# EAGLE design BaseMachine_Exio_Board (EAGLE 7.2.0)
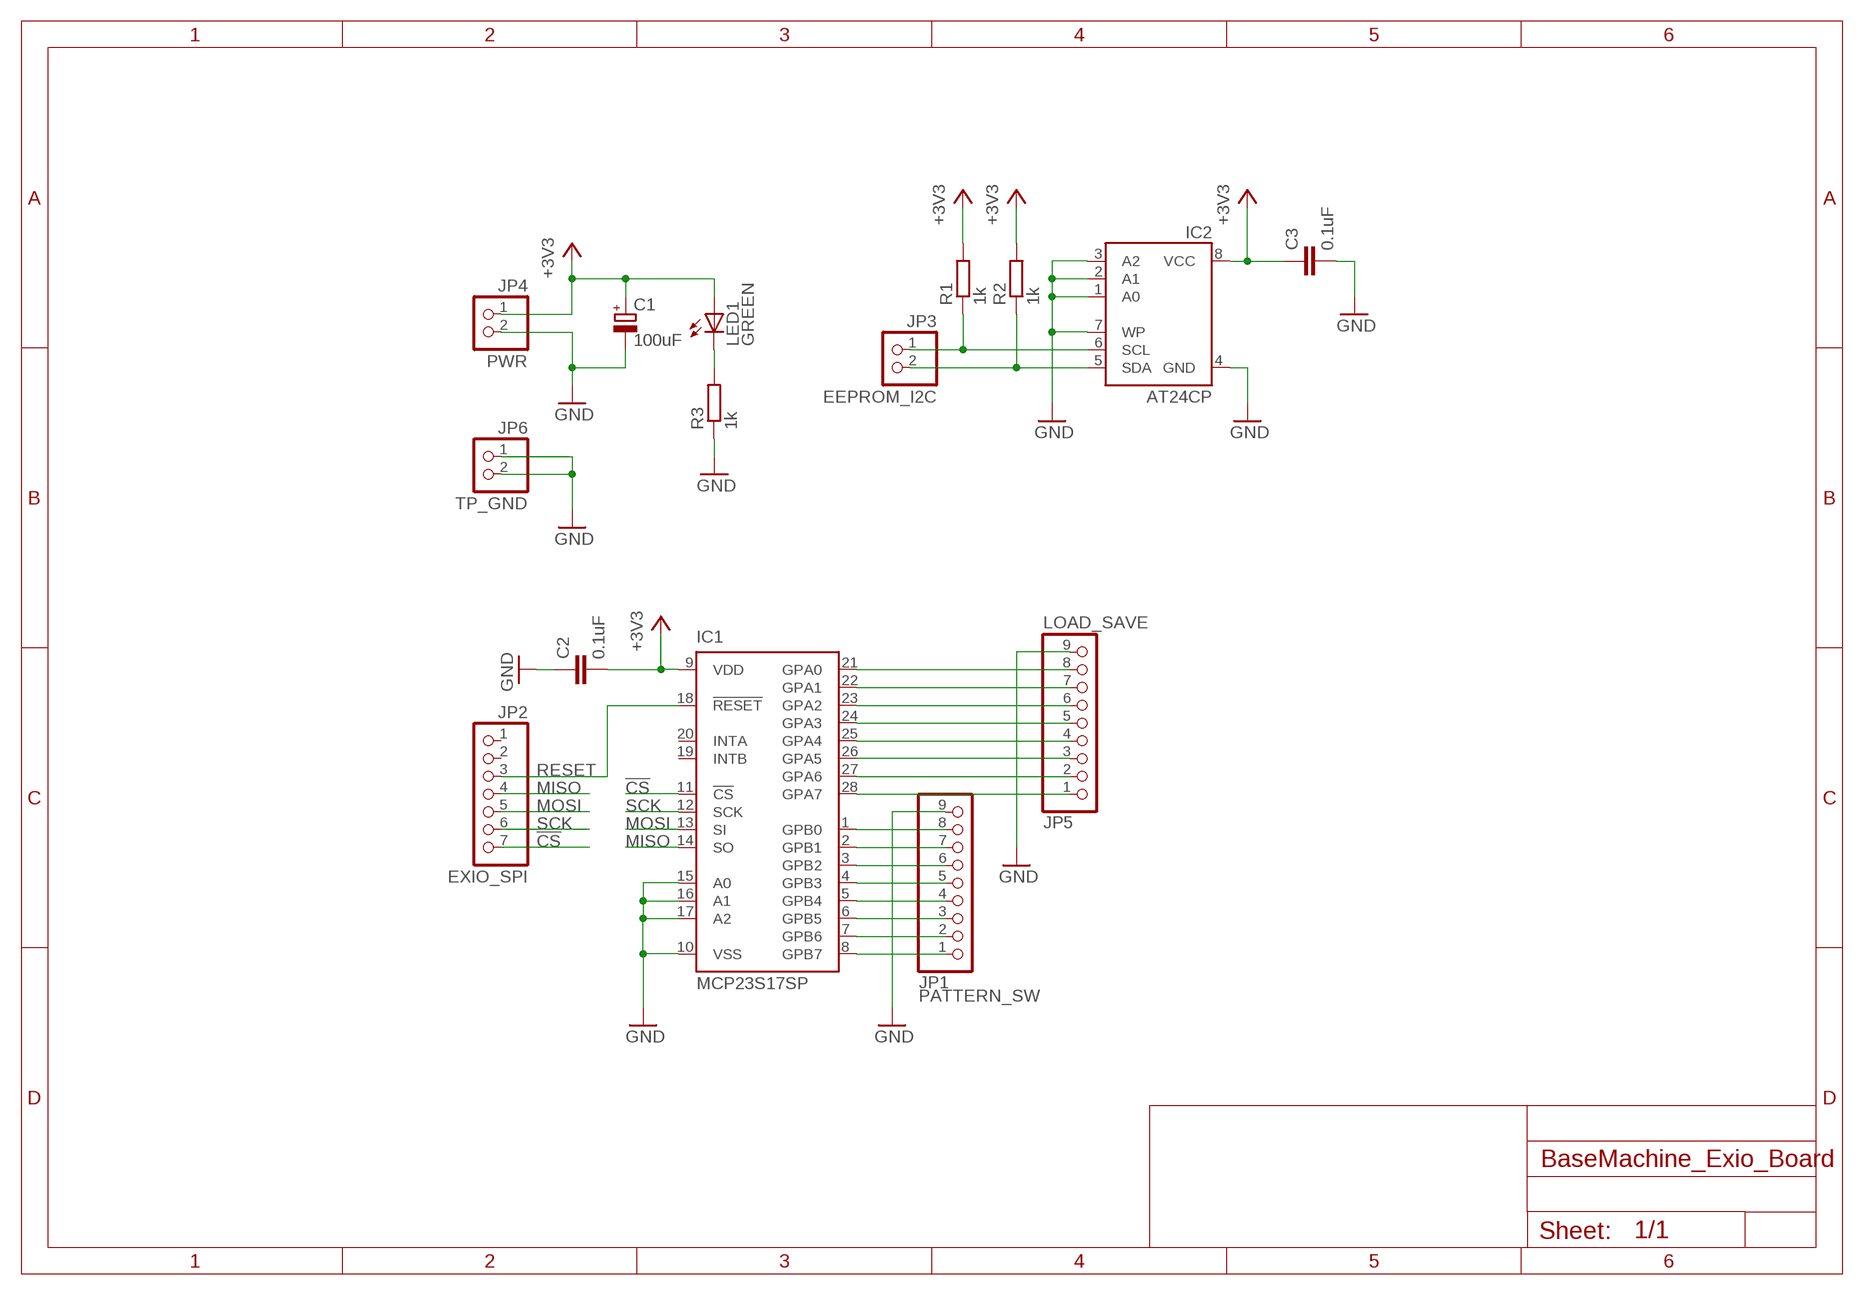
[diagram p0: schematic, sheet 1]

## Parts
C1  100uF  CPOL-EUSANYO_C6  [SANYO-OSCON_C6]
C2  0.1uF  C-EU025-024X044  [C025-024X044]
C3  0.1uF  C-EU025-024X044  [C025-024X044]
IC1  MCP23S17SP  [DIL28-3]
IC2  AT24CP  [DIL08]
JP1  PATTERN_SW  PINHD-1X9/90  [1X09/90]
JP2  EXIO_SPI  PINHD-1X7/90  [1X07/90]
JP3  EEPROM_I2C  PINHD-1X2/90  [1X02/90]
JP4  PWR  PINHD-1X2/90  [1X02/90]
JP5  LOAD_SAVE  PINHD-1X9/90  [1X09/90]
JP6  TP_GND  PINHD-1X2  [1X02]
LED1  GREEN  LED3MM  [LED3MM]
R1  1k  R-EU_0207/7  [0207/7]
R2  1k  R-EU_0207/7  [0207/7]
R3  1k  R-EU_0207/7  [0207/7]

## Nets
!CS: IC1.11(!CS) JP2.7
+3V3: C1.+ C2.2 C3.1 IC1.9(VDD) IC2.8(VCC) JP4.1 LED1.A R1.2 R2.2
GND: C1.- C2.1 C3.2 IC1.10(VSS) IC1.15(A0) IC1.16(A1) IC1.17(A2) IC2.1(A0) IC2.2(A1) IC2.3(A2) IC2.4(GND) IC2.7(WP) JP1.9 JP4.2 JP5.9 JP6.1 JP6.2 R3.1
MISO: IC1.14(SO) JP2.4
MOSI: IC1.13(SI) JP2.5
N$1: IC1.1(GPB0) JP1.8
N$2: IC1.2(GPB1) JP1.7
N$3: IC1.3(GPB2) JP1.6
N$4: IC1.4(GPB3) JP1.5
N$5: IC1.5(GPB4) JP1.4
N$6: IC1.6(GPB5) JP1.3
N$8: IC2.6(SCL) JP3.1 R1.1
N$9: IC2.5(SDA) JP3.2 R2.1
N$10: IC1.7(GPB6) JP1.2
N$11: IC1.21(GPA0) JP5.8
N$12: IC1.22(GPA1) JP5.7
N$13: IC1.23(GPA2) JP5.6
N$14: IC1.8(GPB7) JP1.1
N$21: IC1.24(GPA3) JP5.5
N$22: IC1.25(GPA4) JP5.4
N$23: IC1.26(GPA5) JP5.3
N$24: LED1.K(C) R3.2
N$25: IC1.27(GPA6) JP5.2
N$26: IC1.28(GPA7) JP5.1
RESET: IC1.18(!RESET) JP2.3
SCK: IC1.12(SCK) JP2.6
Unconnected: IC1.19(INTB) IC1.20(INTA) JP2.1 JP2.2

## Library data of the parts
C1 = rcl:CPOL-EU: POLARIZED CAPACITOR, European symbol
C2 C3 = rcl:C-EU: CAPACITOR, European symbol
IC1 = microchip:MCP23S17: http://ww1.microchip.com/downloads/en/DeviceDoc/21952a.pdf Source: http://ww1.microchip.com/downloads/en/DeviceDoc/21952a.pdf; MF: MICROCHIP; MPN: MCP23S17-E/SP; OC_FARNELL: 1292238; OC_NEWARK: 31K2951
IC2 = atmel:AT24C*: 2-wire serial EEPROM; MPN: AT24C1024BW-SH-B; OC_FARNELL: 1362646; OC_NEWARK: 03P2044
JP1 JP5 = pinhead:PINHD-1X9: PIN HEADER
JP2 = pinhead:PINHD-1X7: PIN HEADER
JP3 JP4 JP6 = pinhead:PINHD-1X2: PIN HEADER
LED1 = led:LED: LED OSRAM: - CHIPLED LG R971, LG N971, LY N971, LG Q971, LY Q971, LO R971, LY R971 LH N974, LH R974 LS Q976, LO Q976, LY Q976 LO Q996 - Hyper CHIPLED LW Q18S LB Q993, LB Q99A, LB R99A - SideLED LS A670, LO A670, LY A670, LG A670, LP A670 LB A673, LV A673, LT A673, LW A673 LH A674 LY A675 LS A676, LA A676, LO A676, LY A676, LW A676 LS A679, LY A679, LG A679 - Hyper Micro SIDELED® LS Y876, LA Y876, LO Y876, LY Y876 LT Y87S - SmartLED LW L88C, LW L88S LB L89C, LB L89S, LG L890 LS L89K, LO L89K, LY L89K LS L896, LA L896, LO L896, LY L896 - TOPLED LS T670, LO T670, LY T670, LG T670, LP T670 LSG T670, LSP T670, LSY T670, LOP T670, LYG T670 LG T671, LOG T671, LSG T671 LB T673, LV T673, LT T673, LW T673 LH T674 LS T676, LA T676, LO T676, LY T676, LB T676, LH T676, LSB T676, LW T676 LB T67C, LV T67C, LT T67C, LS T67K, LO T67K, LY T67K, LW E67C LS E67B, LA E67B, LO E67B, LY E67B, LB E67C, LV E67C, LT E67C LW T67C LS T679, LY T679, LG T679 LS T770, LO T770, LY T770, LG T770, LP T770 LB T773, LV T773, LT T773, LW T773 LH T774 LS E675, LA E675, LY E675, LS T675 LS T776, LA T776, LO T776, LY T776, LB T776 LHGB T686 LT T68C, LB T68C - Hyper Mini TOPLED® LB M676 - Mini TOPLED Santana® LG M470 LS M47K, LO M47K, LY M47K Source: http://www.osram.convergy.de LUXEON: - LUMILED® LXK2-PW12-R00, LXK2-PW12-S00, LXK2-PW14-U00, LXK2-PW14-V00 LXK2-PM12-R00, LXK2-PM12-S00, LXK2-PM14-U00 LXK2-PE12-Q00, LXK2-PE12-R00, LXK2-PE12-S00, LXK2-PE14-T00, LXK2-PE14-U00 LXK2-PB12-K00, LXK2-PB12-L00, LXK2-PB12-M00, LXK2-PB14-N00, LXK2-PB14-P00, LXK2-PB14-Q00 LXK2-PR12-L00, LXK2-PR12-M00, LXK2-PR14-Q00, LXK2-PR14-R00 LXK2-PD12-Q00, LXK2-PD12-R00, LXK2-PD12-S00 LXK2-PH12-R00, LXK2-PH12-S00 LXK2-PL12-P00, LXK2-PL12-Q00, LXK2-PL12-R00 Source: www.luxeon.com KINGBRIGHT: KA-3528ASYC Source: www.kingbright.com
R1-R3 = rcl:R-EU_: RESISTOR, European symbol

## Board
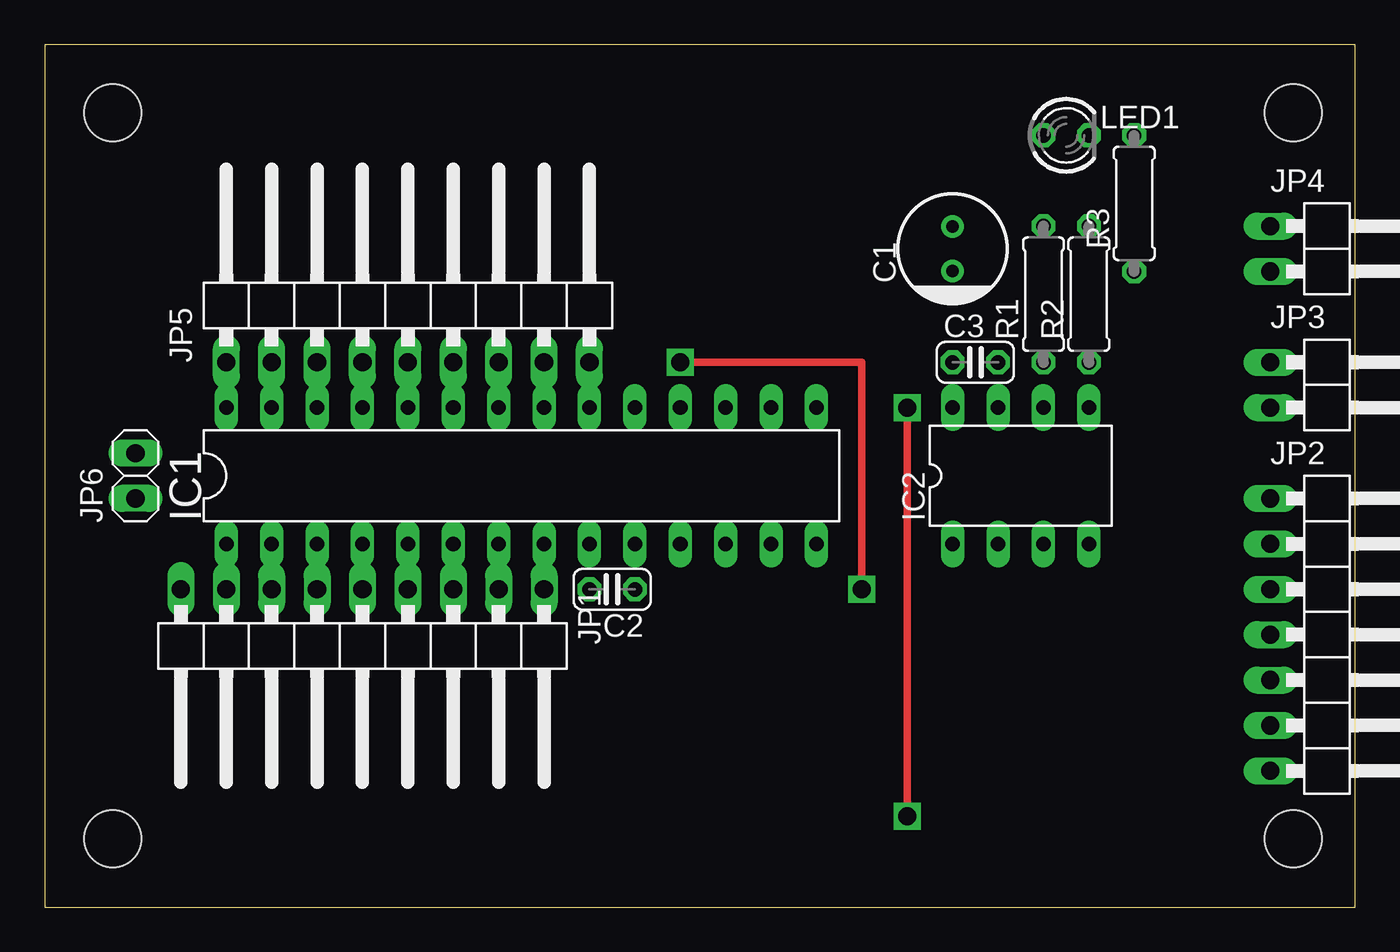
[diagram p1: board, top side]
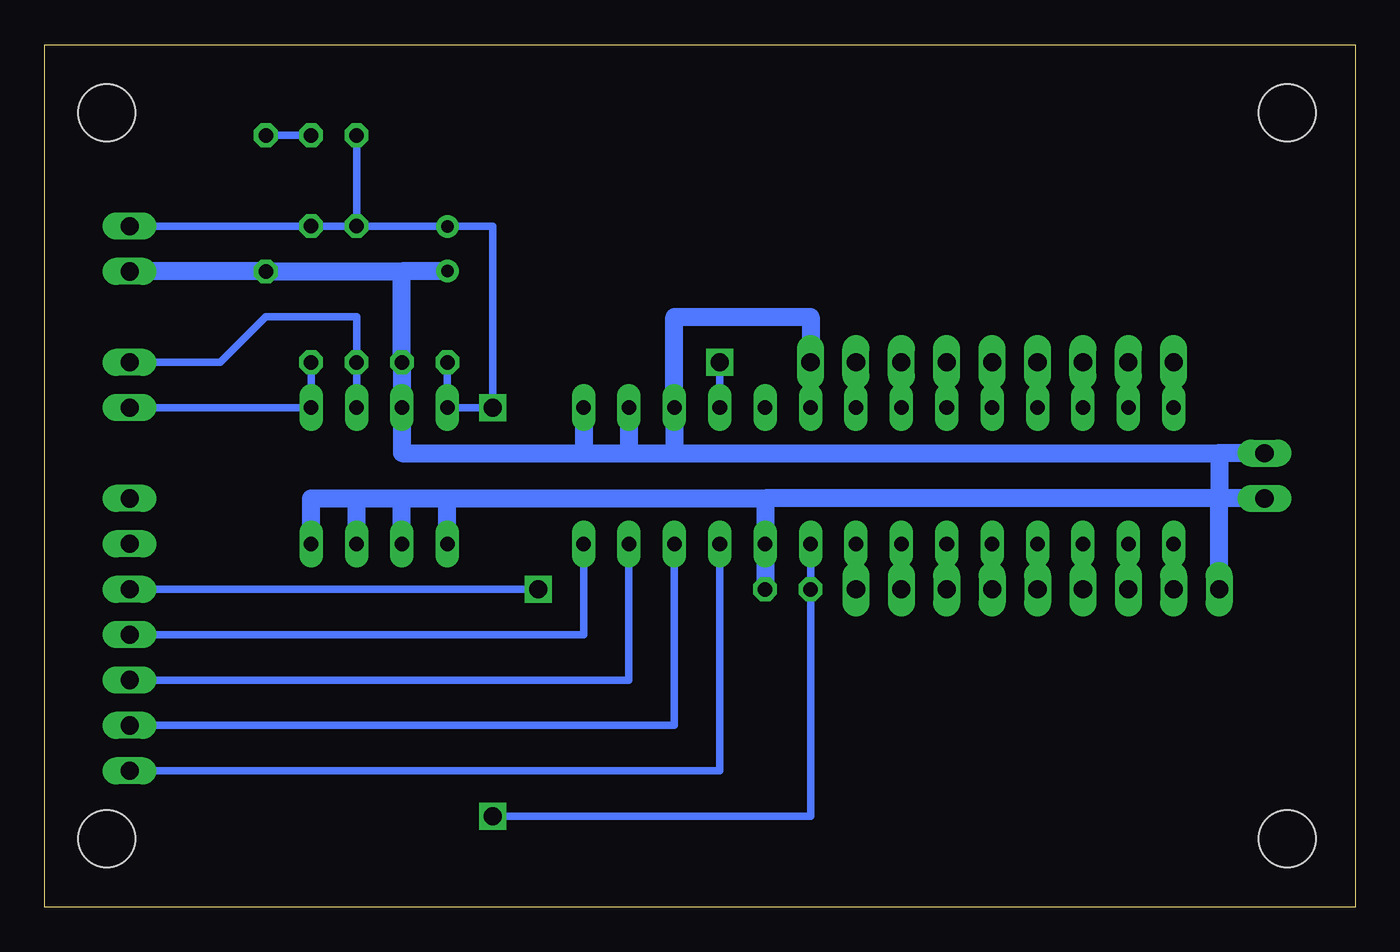
[diagram p2: board, bottom side, seen from below]

Size 73.33 x 48.25 mm. Coordinates in mm from the lower left corner, seen from the top.
Outline: 0,0 73.33,0 73.33,48.25 0,48.25 0,0
Copper layers (1*16): Top 0.035mm / dielectric 1.5mm / Bottom 0.035mm
Design rules "default": minimum track width 10mil, minimum drill 24mil, track to track 8mil, track to pad 8mil, pad to pad 8mil, via to via 8mil, smd to smd 8mil, copper to edge 40mil, drill to drill 8mil, minimum pad ring 10mil, minimum via ring 8mil, stop-mask expansion 4mil, vias tented up to drill 0mil, thermal gap 10mil
Holes 3.2 mm at 3.81,44.45 3.81,3.81 69.85,44.45 69.85,3.81

### Footprints (pad centres in the part's own frame; a part is rotated, then mirrored left to right if it is on the bottom)
SANYO-OSCON_C6 = drill 0.7 pad 1.27: + 1.25,0; - -1.25,0
C025-024X044 = drill 0.813 octagon: 1 -1.27,0; 2 1.27,0
DIL28-3 = drill 0.813 long: 1 -16.51,-3.81; 2 -13.97,-3.81; 3 -11.43,-3.81; 4 -8.89,-3.81; 5 -6.35,-3.81; 6 -3.81,-3.81; 7 -1.27,-3.81; 8 1.27,-3.81; 9 3.81,-3.81; 10 6.35,-3.81; 11 8.89,-3.81; 12 11.43,-3.81; 13 13.97,-3.81; 14 16.51,-3.81; 15 16.51,3.81; 16 13.97,3.81; 17 11.43,3.81; 18 8.89,3.81; 19 6.35,3.81; 20 3.81,3.81; 21 1.27,3.81; 22 -1.27,3.81; 23 -3.81,3.81; 24 -6.35,3.81; 25 -8.89,3.81; 26 -11.43,3.81; 27 -13.97,3.81; 28 -16.51,3.81
DIL08 = drill 0.813 long: 1 -3.81,-3.81; 2 -1.27,-3.81; 3 1.27,-3.81; 4 3.81,-3.81; 5 3.81,3.81; 6 1.27,3.81; 7 -1.27,3.81; 8 -3.81,3.81
1X09/90 = drill 1.016 long: 1 -10.16,-3.81; 2 -7.62,-3.81; 3 -5.08,-3.81; 4 -2.54,-3.81; 5 0,-3.81; 6 2.54,-3.81; 7 5.08,-3.81; 8 7.62,-3.81; 9 10.16,-3.81
1X07/90 = drill 1.016 long: 1 -7.62,-3.81; 2 -5.08,-3.81; 3 -2.54,-3.81; 4 0,-3.81; 5 2.54,-3.81; 6 5.08,-3.81; 7 7.62,-3.81
1X02/90 = drill 1.016 long: 1 -1.27,-3.81; 2 1.27,-3.81
1X02 = drill 1.016 long: 1 -1.27,0; 2 1.27,0
LED3MM = drill 0.813 octagon: A -1.27,0; K 1.27,0
0207/7 = drill 0.813 octagon: 1 -3.81,0; 2 3.81,0

### Placement (x,y rotation side)
C1  50.8,36.83 90 top
C2  31.75,17.78 180 top
C3  52.07,30.48 0 top
IC1  26.67,24.13 0 top
IC2  54.61,24.13 0 top
JP1  17.78,13.97 180 top
JP2  72.39,15.24 270 top
JP3  72.39,29.21 270 top
JP4  72.39,36.83 270 top
JP5  20.32,34.29 0 top
JP6  5.08,24.13 90 top
LED1  57.15,43.18 0 top
R1  55.88,34.29 90 top
R2  58.42,34.29 90 top
R3  60.96,39.37 90 top

### Tracks (layer width: path | path; a pad name or v marks a point on that pad's centre or on a via)
!CS
  Bottom 0.406: JP2.7 35.56,7.62 IC1.11
+3V3  (via drill 1)
  Top 0.406: v48.26,5.08 v48.26,27.94
  Bottom 0.406: JP4.1 R2.2 R1.2 | LED1.A R1.2 | v48.26,5.08 30.48,5.08 C2.2 IC1.9 | C3.1 IC2.8 v48.26,27.94 48.26,38.1 C1.+ R1.2
GND
  Bottom 1.016: JP1.9 7.62,22.86 | 7.62,22.86 33.02,22.86 | 33.02,22.86 IC1.10 C2.1 | 38.1,25.4 IC1.17 38.1,33.02 30.48,33.02 JP5.9 | 38.1,25.4 7.62,25.4 | 7.62,25.4 7.62,22.86 | IC1.16 40.64,25.4 | 40.64,25.4 38.1,25.4 | IC1.15 43.18,25.4 | 43.18,25.4 40.64,25.4 | IC2.1 50.8,22.86 | 50.8,22.86 33.02,22.86 | IC2.2 53.34,22.86 | 53.34,22.86 50.8,22.86 | IC2.3 55.88,22.86 | 55.88,22.86 53.34,22.86 | IC2.4 58.42,22.86 55.88,22.86 | 43.18,25.4 53.34,25.4 IC2.7 C3.2 53.34,35.56 | 53.34,35.56 R3.1 JP4.2 | C1.- 53.34,35.56 | JP6.2 7.62,25.4 | JP6.1 7.62,22.86
MISO
  Bottom 0.406: JP2.4 43.18,15.24 IC1.14
MOSI
  Bottom 0.406: JP2.5 40.64,12.7 IC1.13
N$1
  Bottom 0.406: JP1.8 IC1.1
N$2
  Bottom 0.406: IC1.2 JP1.7
N$3
  Bottom 0.406: JP1.6 IC1.3
N$4
  Bottom 0.406: IC1.4 JP1.5
N$5
  Bottom 0.406: IC1.5 JP1.4
N$6
  Bottom 0.406: IC1.6 JP1.3
N$8
  Bottom 0.406: IC2.6 R1.1 55.88,33.02 60.96,33.02 63.5,30.48 JP3.1
N$9
  Bottom 0.406: R2.1 IC2.5 JP3.2
N$10
  Bottom 0.406: IC1.7 JP1.2
N$11
  Bottom 0.406: JP5.8 IC1.21
N$12
  Bottom 0.406: JP5.7 IC1.22
N$13
  Bottom 0.406: JP5.6 IC1.23
N$14
  Bottom 0.406: IC1.8 JP1.1
N$21
  Bottom 0.406: JP5.5 IC1.24
N$22
  Bottom 0.406: JP5.4 IC1.25
N$23
  Bottom 0.406: JP5.3 IC1.26
N$24
  Bottom 0.406: LED1.K R3.2
N$25
  Bottom 0.406: JP5.2 IC1.27
N$26
  Bottom 0.406: JP5.1 IC1.28
RESET  (via drill 1)
  Top 0.406: v45.72,17.78 45.72,30.48 v35.56,30.48
  Bottom 0.406: JP2.3 v45.72,17.78 | v35.56,30.48 IC1.18
SCK
  Bottom 0.406: JP2.6 38.1,10.16 IC1.12